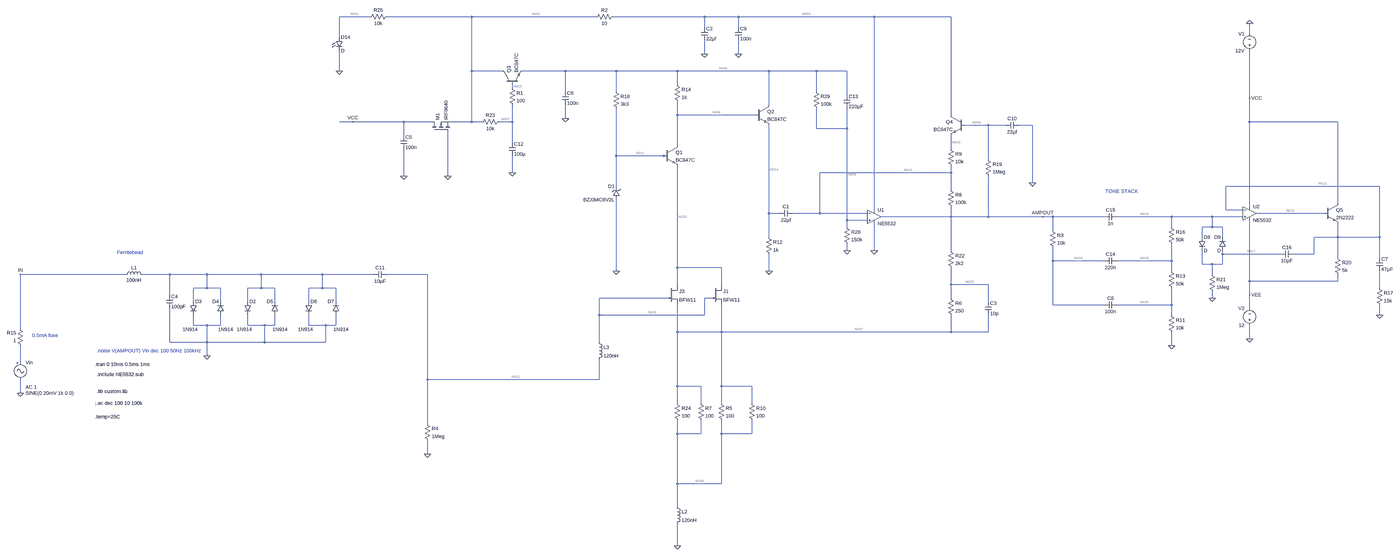
[diagram p0: schematic mosfetpre2.asc, whole sheet]
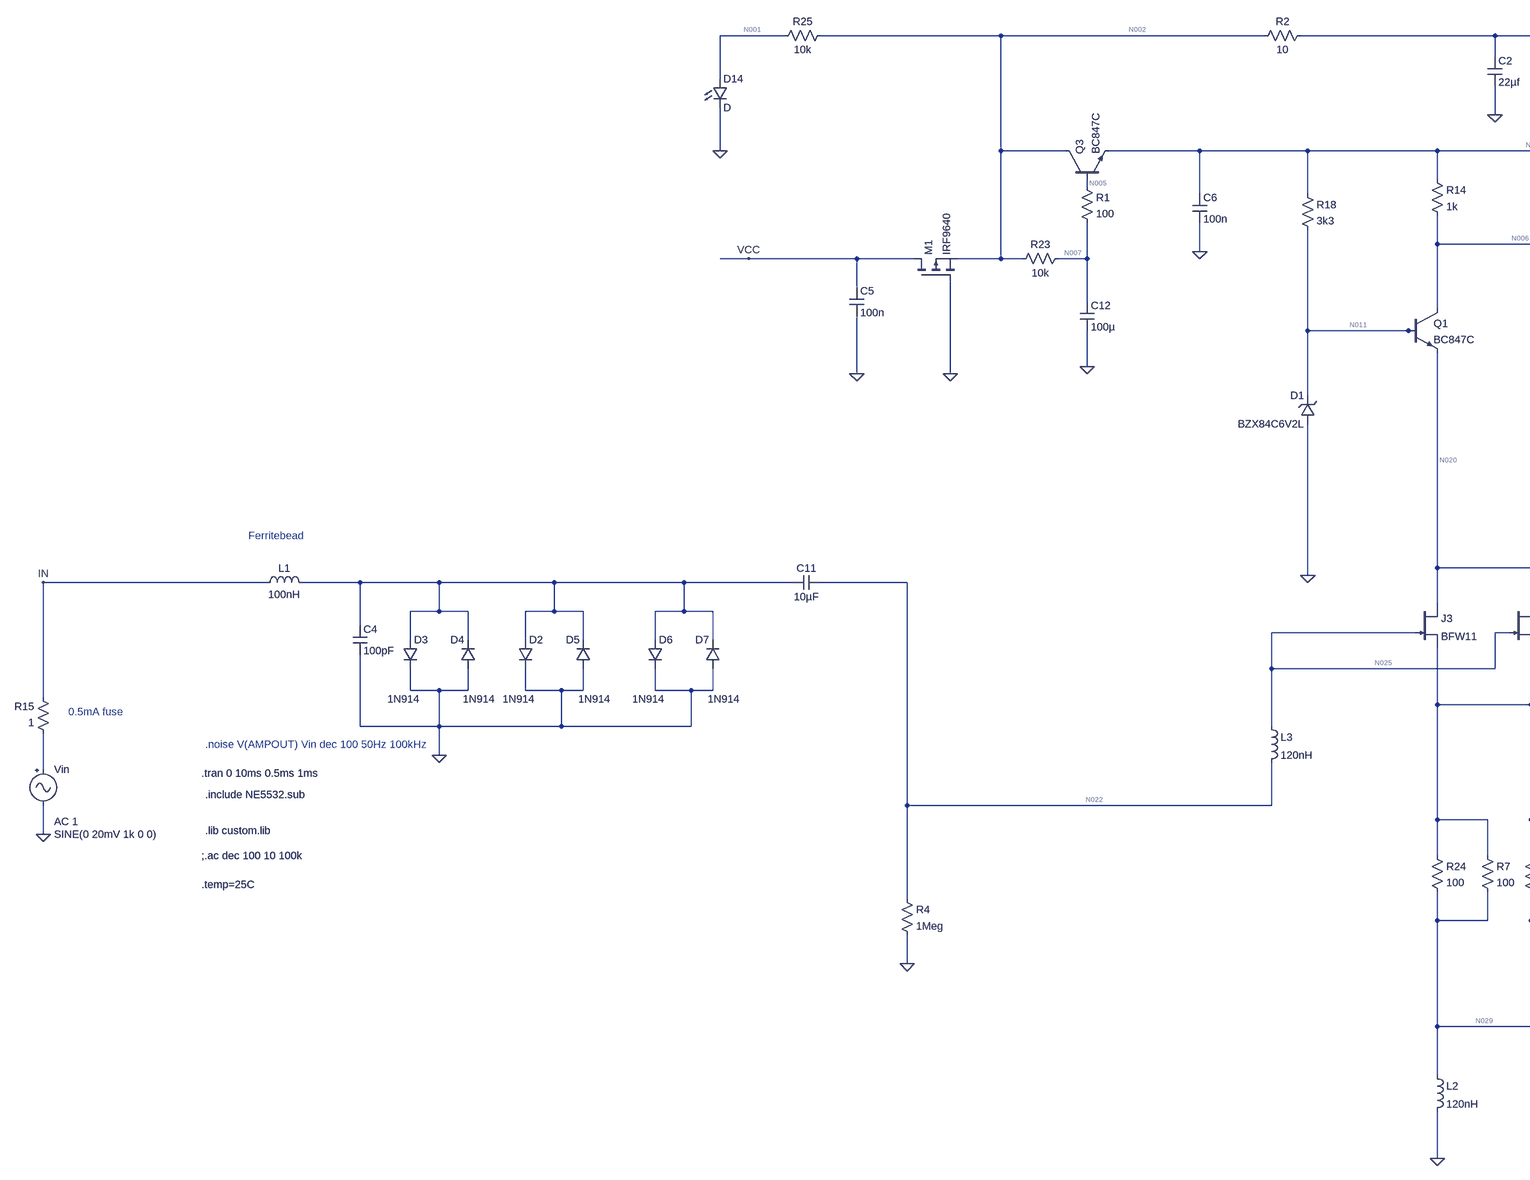
[diagram p1: schematic mosfetpre2.asc, part, row 1 of 1, column 1 of 2]
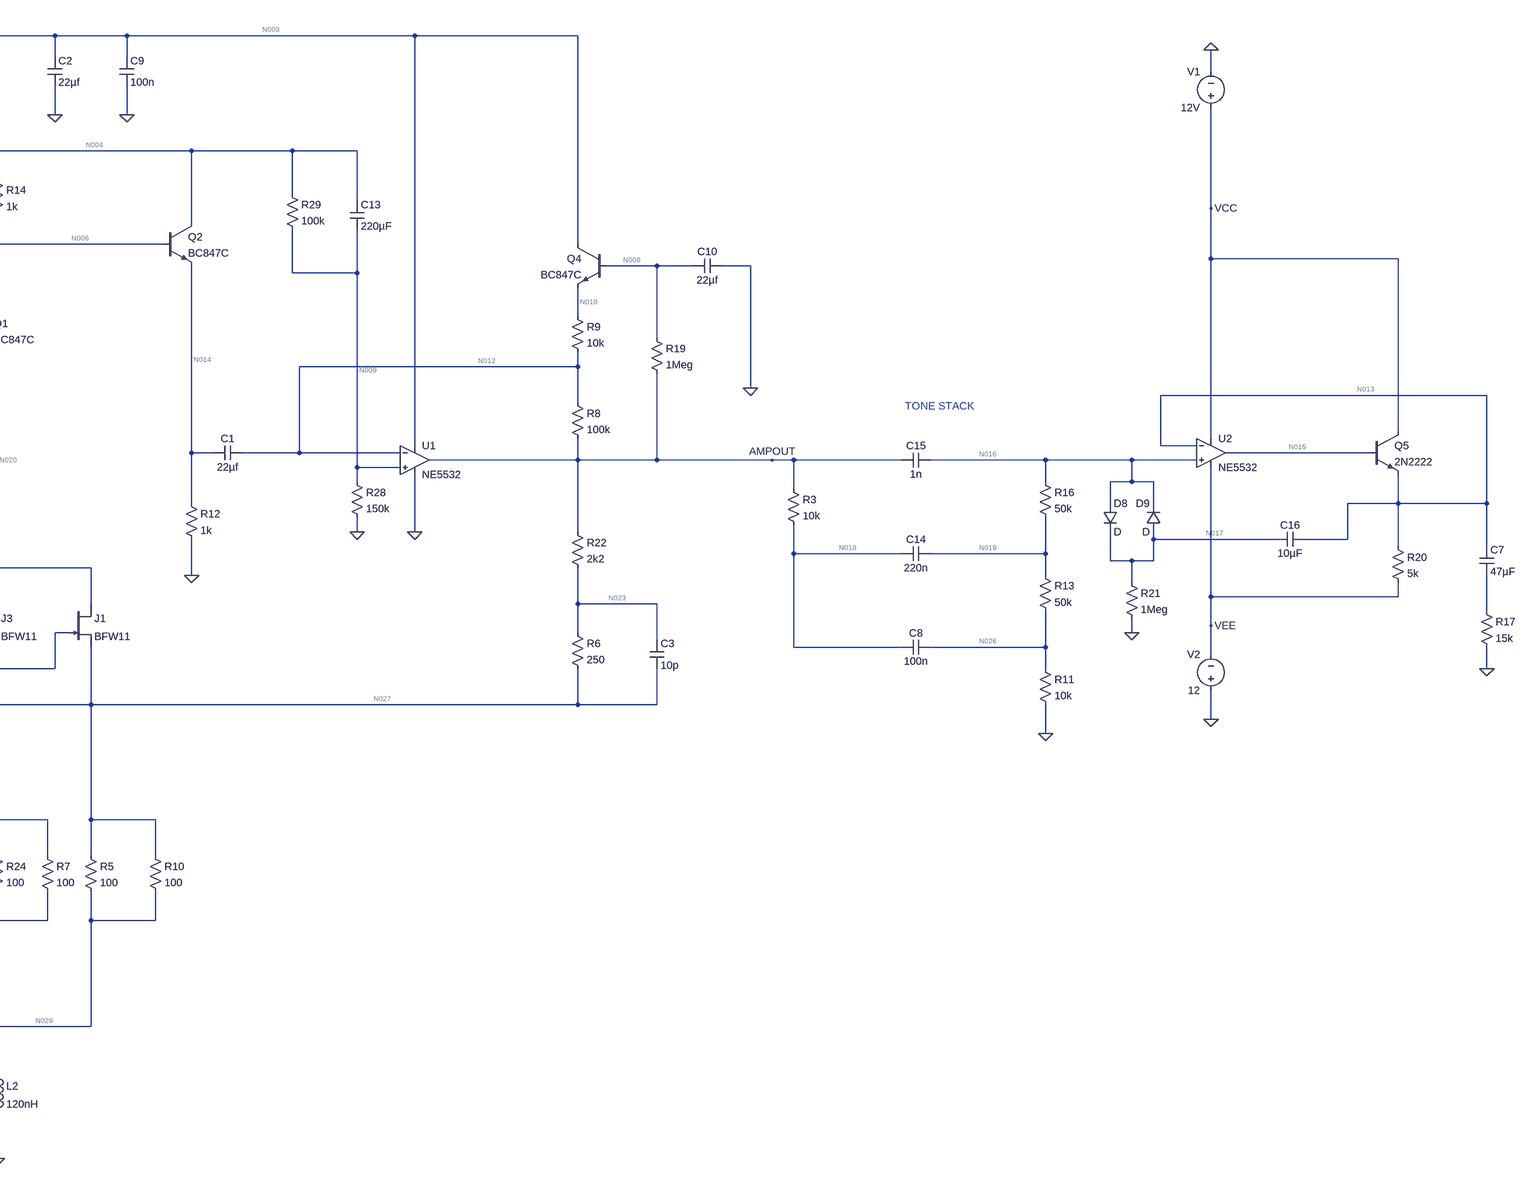
[diagram p2: schematic mosfetpre2.asc, part, row 1 of 1, column 2 of 2]
mosfetpre2.asc, the LTspice schematic file:
Version 4.1
SHEET 1 3440 1556
WIRE -5072 -1184 -5216 -1184
WIRE -4592 -1184 -4992 -1184
WIRE -3984 -1184 -4592 -1184
WIRE -3472 -1184 -3904 -1184
WIRE -3312 -1184 -3472 -1184
WIRE -2672 -1184 -3312 -1184
WIRE -2096 -1184 -2672 -1184
WIRE -3472 -1136 -3472 -1184
WIRE -3312 -1136 -3312 -1184
WIRE -688 -1104 -688 -1152
WIRE -5216 -1088 -5216 -1184
WIRE -3472 -1008 -3472 -1072
WIRE -3312 -1008 -3312 -1072
WIRE -5216 -928 -5216 -1024
WIRE -4592 -928 -4592 -1184
WIRE -4448 -928 -4592 -928
WIRE -4128 -928 -4352 -928
WIRE -3888 -928 -4128 -928
WIRE -3600 -928 -3888 -928
WIRE -3168 -928 -3600 -928
WIRE -2944 -928 -3168 -928
WIRE -2800 -928 -2944 -928
WIRE -3600 -864 -3600 -928
WIRE -4400 -848 -4400 -864
WIRE -4128 -832 -4128 -928
WIRE -3888 -832 -3888 -928
WIRE -2944 -832 -2944 -928
WIRE -2800 -816 -2800 -928
WIRE -688 -800 -688 -1024
WIRE -3168 -768 -3168 -928
WIRE -3600 -720 -3600 -784
WIRE -3232 -720 -3600 -720
WIRE -2096 -720 -2096 -1184
WIRE -4128 -704 -4128 -768
WIRE -5152 -688 -5216 -688
WIRE -4912 -688 -5152 -688
WIRE -4784 -688 -4912 -688
WIRE -4592 -688 -4592 -928
WIRE -4592 -688 -4688 -688
WIRE -4544 -688 -4592 -688
WIRE -4400 -688 -4400 -768
WIRE -4400 -688 -4464 -688
WIRE -688 -688 -688 -800
WIRE -272 -688 -688 -688
WIRE -1920 -672 -2032 -672
WIRE -1840 -672 -1920 -672
WIRE -1712 -672 -1776 -672
WIRE -2944 -656 -2944 -752
WIRE -2800 -656 -2800 -752
WIRE -2800 -656 -2944 -656
WIRE -4912 -624 -4912 -688
WIRE -4400 -592 -4400 -688
WIRE -3600 -576 -3600 -720
WIRE -2096 -560 -2096 -624
WIRE -3888 -528 -3888 -752
WIRE -3664 -528 -3888 -528
WIRE -3648 -528 -3664 -528
WIRE -1920 -512 -1920 -672
WIRE -4400 -448 -4400 -528
WIRE -2096 -448 -2096 -480
WIRE -2096 -448 -2928 -448
WIRE -4912 -432 -4912 -560
WIRE -4704 -432 -4704 -640
WIRE -1712 -400 -1712 -672
WIRE -3888 -384 -3888 -528
WIRE 112 -384 -800 -384
WIRE -2096 -368 -2096 -448
WIRE -272 -304 -272 -688
WIRE -688 -288 -688 -688
WIRE -2672 -272 -2672 -1184
WIRE -800 -272 -800 -384
WIRE -720 -272 -800 -272
WIRE -3168 -256 -3168 -672
WIRE -3120 -256 -3168 -256
WIRE -2928 -256 -2928 -448
WIRE -2928 -256 -3056 -256
WIRE -2704 -256 -2928 -256
WIRE -336 -256 -656 -256
WIRE -2096 -240 -2096 -288
WIRE -2096 -240 -2640 -240
WIRE -1920 -240 -1920 -432
WIRE -1920 -240 -2096 -240
WIRE -1664 -240 -1920 -240
WIRE -1616 -240 -1664 -240
WIRE -1376 -240 -1616 -240
WIRE -1056 -240 -1312 -240
WIRE -864 -240 -1056 -240
WIRE -720 -240 -864 -240
WIRE -2800 -224 -2800 -656
WIRE -2704 -224 -2800 -224
WIRE -2800 -192 -2800 -224
WIRE -1056 -192 -1056 -240
WIRE -864 -192 -864 -240
WIRE -864 -192 -912 -192
WIRE -816 -192 -864 -192
WIRE -1616 -176 -1616 -240
WIRE -3168 -144 -3168 -256
WIRE -912 -144 -912 -192
WIRE -816 -144 -816 -192
WIRE -272 -144 -272 -208
WIRE -272 -144 -384 -144
WIRE 112 -144 112 -384
WIRE 112 -144 -272 -144
WIRE -2800 -80 -2800 -112
WIRE -2672 -80 -2672 -208
WIRE -2096 -80 -2096 -240
WIRE -816 -64 -816 -80
WIRE -544 -64 -816 -64
WIRE -384 -64 -384 -144
WIRE -384 -64 -480 -64
WIRE -272 -48 -272 -144
WIRE 112 -48 112 -144
WIRE -1616 -32 -1616 -96
WIRE -1376 -32 -1616 -32
WIRE -1056 -32 -1056 -112
WIRE -1056 -32 -1312 -32
WIRE -912 -16 -912 -80
WIRE -864 -16 -912 -16
WIRE -816 -16 -816 -64
WIRE -816 -16 -864 -16
WIRE -3600 0 -3600 -480
WIRE -3392 0 -3600 0
WIRE -3888 16 -3888 -320
WIRE -3168 16 -3168 -64
WIRE -1056 16 -1056 -32
WIRE -6224 32 -6720 32
WIRE -6016 32 -6144 32
WIRE -5840 32 -6016 32
WIRE -5584 32 -5840 32
WIRE -5296 32 -5584 32
WIRE -5056 32 -5296 32
WIRE -4800 32 -4992 32
WIRE -864 32 -864 -16
WIRE -688 64 -688 -224
WIRE -272 64 -272 32
WIRE -272 64 -688 64
WIRE -3600 80 -3600 0
WIRE -3392 80 -3392 0
WIRE -2096 80 -2096 0
WIRE -1920 80 -2096 80
WIRE -5840 96 -5840 32
WIRE -5840 96 -5904 96
WIRE -5776 96 -5840 96
WIRE -5584 96 -5584 32
WIRE -5584 96 -5648 96
WIRE -5520 96 -5584 96
WIRE -5296 96 -5296 32
WIRE -5296 96 -5360 96
WIRE -5232 96 -5296 96
WIRE 112 96 112 16
WIRE -6016 128 -6016 32
WIRE -688 128 -688 64
WIRE -3648 144 -3968 144
WIRE -3440 144 -3472 144
WIRE -2096 144 -2096 80
WIRE -864 144 -864 112
WIRE -5904 160 -5904 96
WIRE -5776 160 -5776 96
WIRE -5648 160 -5648 96
WIRE -5520 160 -5520 96
WIRE -5360 160 -5360 96
WIRE -5232 160 -5232 96
WIRE -1920 160 -1920 80
WIRE -1616 176 -1616 -32
WIRE -1376 176 -1616 176
WIRE -1056 176 -1056 96
WIRE -1056 176 -1312 176
WIRE -688 192 -688 128
WIRE -3968 224 -3968 144
WIRE -3472 224 -3472 144
WIRE -3472 224 -3968 224
WIRE -1056 224 -1056 176
WIRE 112 224 112 176
WIRE -5904 272 -5904 224
WIRE -5840 272 -5904 272
WIRE -5776 272 -5776 224
WIRE -5776 272 -5840 272
WIRE -5648 272 -5648 224
WIRE -5568 272 -5648 272
WIRE -5520 272 -5520 224
WIRE -5520 272 -5568 272
WIRE -5360 272 -5360 224
WIRE -5280 272 -5360 272
WIRE -5232 272 -5232 224
WIRE -5232 272 -5280 272
WIRE -6720 288 -6720 32
WIRE -3600 304 -3600 176
WIRE -3392 304 -3392 176
WIRE -3392 304 -3600 304
WIRE -2096 304 -2096 224
WIRE -2096 304 -3392 304
WIRE -1920 304 -1920 224
WIRE -1920 304 -2096 304
WIRE -688 336 -688 272
WIRE -6016 352 -6016 192
WIRE -5840 352 -5840 272
WIRE -5840 352 -6016 352
WIRE -5568 352 -5568 272
WIRE -5568 352 -5840 352
WIRE -5280 352 -5280 272
WIRE -5280 352 -5568 352
WIRE -3968 352 -3968 224
WIRE -1056 368 -1056 304
WIRE -5840 416 -5840 352
WIRE -6720 448 -6720 368
WIRE -4800 528 -4800 32
WIRE -3968 528 -3968 432
WIRE -3968 528 -4800 528
WIRE -3600 560 -3600 304
WIRE -3488 560 -3600 560
WIRE -3392 560 -3392 304
WIRE -3248 560 -3392 560
WIRE -6720 592 -6720 528
WIRE -3600 640 -3600 560
WIRE -3488 640 -3488 560
WIRE -3392 640 -3392 560
WIRE -3248 640 -3248 560
WIRE -4800 736 -4800 528
WIRE -3600 784 -3600 720
WIRE -3488 784 -3488 720
WIRE -3488 784 -3600 784
WIRE -3392 784 -3392 720
WIRE -3248 784 -3248 720
WIRE -3248 784 -3392 784
WIRE -4800 880 -4800 816
WIRE -3600 1040 -3600 784
WIRE -3392 1040 -3392 784
WIRE -3392 1040 -3600 1040
WIRE -3600 1248 -3600 1040
WIRE -3600 1488 -3600 1328
FLAG -6720 592 0
FLAG -6720 32 IN
FLAG -4800 880 0
FLAG -5840 416 0
FLAG -3168 16 0
FLAG -3888 16 0
FLAG -2800 -80 0
FLAG -3600 1488 0
FLAG -1712 -400 0
FLAG -4704 -432 0
FLAG -4400 -448 0
FLAG -5216 -928 0
FLAG -3472 -1008 0
FLAG -3312 -1008 0
FLAG -4912 -432 0
FLAG -4128 -704 0
FLAG -1664 -240 AMPOUT
FLAG -2672 -80 0
FLAG -1056 368 0
FLAG -688 -1152 0
FLAG 112 224 0
FLAG -688 336 0
FLAG -5152 -688 VCC
FLAG -688 128 VEE
FLAG -688 -800 VCC
FLAG -864 144 0
DATAFLAG -3744 -528 ""
DATAFLAG -3856 144 ""
DATAFLAG -3568 304 ""
DATAFLAG -3600 -304 ""
DATAFLAG -3520 -720 ""
DATAFLAG -4032 -928 ""
DATAFLAG -4304 -1184 ""
SYMBOL Misc\\signal -6720 432 R0
WINDOW 123 24 132 Left 2
WINDOW 39 0 0 Left 0
WINDOW 3 24 160 Left 2
SYMATTR Value2 AC 1
SYMATTR Value SINE(0 20mV 1k 0 0)
SYMATTR InstName Vin
SYMBOL res -4816 720 R0
SYMATTR InstName R4
SYMATTR Value 1Meg
SYMBOL diode -5920 160 R0
WINDOW 3 -35 131 Left 2
SYMATTR Value 1N914
SYMATTR InstName D3
SYMBOL diode -5760 224 R180
WINDOW 0 24 64 Left 2
WINDOW 3 -44 -67 Left 2
SYMATTR InstName D4
SYMATTR Value 1N914
SYMBOL res -6704 384 R180
WINDOW 0 36 76 Left 2
WINDOW 3 36 40 Left 2
SYMATTR InstName R15
SYMATTR Value 1
SYMBOL cap -6032 128 R0
SYMATTR InstName C4
SYMATTR Value 100pF
SYMBOL ind -6240 48 R270
WINDOW 0 32 56 VTop 2
WINDOW 3 5 56 VBottom 2
SYMATTR InstName L1
SYMATTR Value 100nH
SYMBOL cap -4992 16 R90
WINDOW 0 0 32 VBottom 2
WINDOW 3 32 32 VTop 2
SYMATTR InstName C11
SYMATTR Value 10µF
SYMBOL cap -3056 -272 R90
WINDOW 0 0 32 VBottom 2
WINDOW 3 32 32 VTop 2
SYMATTR InstName C1
SYMATTR Value 22µf
SYMBOL res -3184 -160 R0
SYMATTR InstName R12
SYMATTR Value 1k
SYMBOL res -3904 -848 R0
SYMATTR InstName R18
SYMATTR Value 3k3
SYMBOL res -3616 -880 R0
SYMATTR InstName R14
SYMATTR Value 1k
SYMBOL npn -2032 -720 M0
SYMATTR InstName Q4
SYMATTR Value BC847C
SYMBOL res -2112 -96 R0
SYMATTR InstName R22
SYMATTR Value 2k2
SYMBOL njf -3648 80 R0
SYMATTR InstName J3
SYMATTR Value BFW11
SYMBOL res -3616 624 R0
SYMATTR InstName R24
SYMATTR Value 100
SYMBOL res -1936 -528 R0
SYMATTR InstName R19
SYMATTR Value 1Meg
SYMBOL ind -3616 1232 R0
SYMATTR InstName L2
SYMATTR Value 120nH
SYMBOL ind -3984 336 R0
SYMATTR InstName L3
SYMATTR Value 120nH
SYMBOL cap -1776 -688 R90
WINDOW 0 0 32 VBottom 2
WINDOW 3 32 32 VTop 2
SYMATTR InstName C10
SYMATTR Value 22µf
SYMBOL pmos -4784 -640 R270
SYMATTR InstName M1
SYMATTR Value IRF9640
SYMBOL res -4416 -864 R0
SYMATTR InstName R1
SYMATTR Value 100
SYMBOL res -4448 -704 R90
WINDOW 0 0 56 VBottom 2
WINDOW 3 32 56 VTop 2
SYMATTR InstName R23
SYMATTR Value 10k
SYMBOL cap -4416 -592 R0
SYMATTR InstName C12
SYMATTR Value 100µ
SYMBOL res -4976 -1200 R90
WINDOW 0 0 56 VBottom 2
WINDOW 3 32 56 VTop 2
SYMATTR InstName R25
SYMATTR Value 10k
SYMBOL LED -5232 -1088 R0
SYMATTR InstName D14
SYMBOL res -2816 -208 R0
SYMATTR InstName R28
SYMATTR Value 150k
SYMBOL cap -2816 -816 R0
SYMATTR InstName C13
SYMATTR Value 220µF
SYMBOL res -2960 -848 R0
SYMATTR InstName R29
SYMATTR Value 100k
SYMBOL cap -3488 -1136 R0
SYMATTR InstName C2
SYMATTR Value 22µf
SYMBOL cap -3328 -1136 R0
SYMATTR InstName C9
SYMATTR Value 100n
SYMBOL res -3888 -1200 R90
WINDOW 0 0 56 VBottom 2
WINDOW 3 32 56 VTop 2
SYMATTR InstName R2
SYMATTR Value 10
SYMBOL cap -4928 -624 R0
SYMATTR InstName C5
SYMATTR Value 100n
SYMBOL cap -4144 -832 R0
SYMATTR InstName C6
SYMATTR Value 100n
SYMBOL res -1632 -192 R0
SYMATTR InstName R3
SYMATTR Value 10k
SYMBOL npn -3664 -576 R0
SYMATTR InstName Q1
SYMATTR Value BC847C
SYMBOL npn -4448 -864 R270
SYMATTR InstName Q3
SYMATTR Value BC847C
SYMBOL npn -3232 -768 R0
SYMATTR InstName Q2
SYMATTR Value BC847C
SYMBOL OpAmps\\opamp2 -2672 -304 R0
SYMATTR InstName U1
SYMATTR Value NE5532
SYMBOL njf -3440 80 R0
SYMATTR InstName J1
SYMATTR Value BFW11
SYMBOL res -3408 624 R0
SYMATTR InstName R5
SYMATTR Value 100
SYMBOL zener -3872 -320 R180
WINDOW 0 24 64 Left 2
WINDOW 3 24 0 Left 2
SYMATTR InstName D1
SYMATTR Value BZX84C6V2L
SYMBOL res -2112 128 R0
SYMATTR InstName R6
SYMATTR Value 250
SYMBOL cap -1936 160 R0
SYMATTR InstName C3
SYMATTR Value 10p
SYMBOL res -2112 -384 R0
SYMATTR InstName R8
SYMATTR Value 100k
SYMBOL res -2112 -576 R0
SYMATTR InstName R9
SYMATTR Value 10k
SYMBOL res -3504 624 R0
SYMATTR InstName R7
SYMATTR Value 100
SYMBOL res -3264 624 R0
SYMATTR InstName R10
SYMATTR Value 100
SYMBOL diode -5664 160 R0
WINDOW 3 -35 131 Left 2
SYMATTR Value 1N914
SYMATTR InstName D2
SYMBOL diode -5504 224 R180
WINDOW 0 24 64 Left 2
WINDOW 3 -44 -67 Left 2
SYMATTR InstName D5
SYMATTR Value 1N914
SYMBOL diode -5376 160 R0
WINDOW 3 -35 131 Left 2
SYMATTR Value 1N914
SYMATTR InstName D6
SYMBOL diode -5216 224 R180
WINDOW 0 24 64 Left 2
WINDOW 3 -44 -67 Left 2
SYMATTR InstName D7
SYMATTR Value 1N914
SYMBOL cap -1312 160 R90
WINDOW 0 0 32 VBottom 2
WINDOW 3 32 32 VTop 2
SYMATTR InstName C8
SYMATTR Value 100n
SYMBOL cap -1312 -48 R90
WINDOW 0 0 32 VBottom 2
WINDOW 3 32 32 VTop 2
SYMATTR InstName C14
SYMATTR Value 220n
SYMBOL cap -1312 -256 R90
WINDOW 0 0 32 VBottom 2
WINDOW 3 32 32 VTop 2
SYMATTR InstName C15
SYMATTR Value 1n
SYMBOL res -1072 208 R0
SYMATTR InstName R11
SYMATTR Value 10k
SYMBOL res -1072 0 R0
SYMATTR InstName R13
SYMATTR Value 50k
SYMBOL res -1072 -208 R0
SYMATTR InstName R16
SYMATTR Value 50k
SYMBOL OpAmps\\opamp2 -688 -320 R0
SYMATTR InstName U2
SYMATTR Value NE5532
SYMBOL voltage -688 -1008 R180
WINDOW 0 24 96 Left 2
WINDOW 3 24 16 Left 2
WINDOW 123 0 0 Left 0
WINDOW 39 0 0 Left 0
SYMATTR InstName V1
SYMATTR Value 12V
SYMBOL res 96 80 R0
SYMATTR InstName R17
SYMATTR Value 15k
SYMBOL voltage -688 288 R180
WINDOW 0 24 96 Left 2
WINDOW 3 24 16 Left 2
WINDOW 123 0 0 Left 0
WINDOW 39 0 0 Left 0
SYMATTR InstName V2
SYMATTR Value 12
SYMBOL npn -336 -304 R0
SYMATTR InstName Q5
SYMATTR Value 2N2222
SYMBOL res -288 -64 R0
SYMATTR InstName R20
SYMATTR Value 5k
SYMBOL cap 96 -48 R0
SYMATTR InstName C7
SYMATTR Value 47µF
SYMBOL diode -928 -144 R0
SYMATTR InstName D8
SYMBOL diode -800 -80 R180
WINDOW 0 24 64 Left 2
WINDOW 3 24 0 Left 2
SYMATTR InstName D9
SYMBOL res -880 16 R0
SYMATTR InstName R21
SYMATTR Value 1Meg
SYMBOL cap -480 -80 R90
WINDOW 0 0 32 VBottom 2
WINDOW 3 32 32 VTop 2
SYMATTR InstName C16
SYMATTR Value 10µF
TEXT -6360 584 Left 2 !.lib custom.lib
TEXT -6360 392 Left 2 ;.noise V(AMPOUT) Vin dec 100 50Hz 100kHz
TEXT -6368 456 Left 2 !.tran 0 10ms 0.5ms 1ms
TEXT -6368 640 Left 2 !;.ac dec 100 10 100k
TEXT -6664 320 Left 2 ;0.5mA fuse
TEXT -6264 -72 Left 2 ;Ferritebead
TEXT -6368 704 Left 2 !.temp=25C
TEXT -6360 504 Left 2 !.include NE5532.sub
TEXT -1368 -360 Left 2 ;TONE STACK

The netlist it stands for:
* mosfetpre2.asc
Vin N028 0 SINE(0 20mV 1k 0 0) AC 1
R4 N022 0 1Meg
D3 N021 0 1N914
D4 0 N021 1N914
R15 N028 IN 1
C4 N021 0 100pF
L1 IN N021 100nH
C11 N022 N021 10µF
C1 N012 N014 22µf
R12 N014 0 1k
R18 N004 N011 3k3
R14 N004 N006 1k
Q4 N003 N008 N010 0 BC847C
R22 AMPOUT N023 2k2
J3 N020 N025 N027 BFW11
R24 N027 N029 100
R19 N008 AMPOUT 1Meg
L2 N029 0 120nH
L3 N025 N022 120nH
C10 0 N008 22µf
M1 VCC 0 N002 N002 IRF9640
R1 N005 N007 100
R23 N007 N002 10k
C12 N007 0 100µ
R25 N002 N001 10k
D14 N001 0 D
R28 N009 0 150k
C13 N004 N009 220µF
R29 N004 N009 100k
C2 N003 0 22µf
C9 N003 0 100n
R2 N003 N002 10
C5 VCC 0 100n
C6 N004 0 100n
R3 AMPOUT N018 10k
Q1 N006 N011 N020 0 BC847C
Q3 N002 N005 N004 0 BC847C
Q2 N004 N006 N014 0 BC847C
X§U1 N009 N012 N003 0 AMPOUT NE5532  ; pins In+ In- V+ V- OUT
J1 N020 N025 N027 BFW11
R5 N027 N029 100
D1 0 N011 BZX84C6V2L
R6 N023 N027 250
C3 N023 N027 10p
R8 N012 AMPOUT 100k
R9 N010 N012 10k
R7 N027 N029 100
R10 N027 N029 100
D2 N021 0 1N914
D5 0 N021 1N914
D6 N021 0 1N914
D7 0 N021 1N914
C8 N026 N018 100n
C14 N019 N018 220n
C15 N016 AMPOUT 1n
R11 N026 0 10k
R13 N019 N026 50k
R16 N016 N019 50k
X§U2 N016 N013 VCC VEE N015 NE5532  ; pins In+ In- V+ V- OUT
V1 VCC 0 12V
R17 N024 0 15k
V2 0 VEE 12
Q5 VCC N015 N013 0 2N2222
R20 N013 VEE 5k
C7 N013 N024 47µF
D8 N016 N017 D
D9 N017 N016 D
R21 N017 0 1Meg
C16 N013 N017 10µF
.model D D
.lib standard.dio
.model NPN NPN
.model PNP PNP
.lib standard.bjt
.model NJF NJF
.model PJF PJF
.lib standard.jft
.model NMOS NMOS
.model PMOS PMOS
.lib standard.mos
.lib custom.lib
* .noise V(AMPOUT) Vin dec 100 50Hz 100kHz
.tran 0 10ms 0.5ms 1ms
;.ac dec 100 10 100k
* 0.5mA fuse
* Ferritebead
.temp=25C
.include NE5532.sub
* TONE STACK
.backanno
.end

* Results of the author's LTspice run, read from the files saved beside the schematic
* Operating Point, zero values left out:
*   V(n022) = 9.322 µV
*   V(n012) = 6.573 V
*   V(n003) = 11.98 V
*   V(ampout) = 6.623 V
*   V(n029) = 10.96 µV
*   V(n001) = 661.9 mV
*   V(n026) = -4.982 mV
*   V(n015) = 624.1 mV
*   V(n004) = 11.01 V
*   V(n010) = 6.573 V
*   V(n020) = 4.387 V
*   V(n002) = 12 V
*   V(n018) = 6.623 V
*   V(n016) = -54.8 mV
*   V(n017) = -170.7 nV
*   V(vee) = -12 V
*   V(n014) = 3.744 V
*   V(n006) = 4.41 V
*   V(n023) = 922 mV
*   V(n027) = 274.1 mV
*   V(vcc) = 12 V
*   V(n007) = 11.72 V
*   V(n019) = -29.89 mV
*   V(n013) = -54.8 mV
*   V(n011) = 5.119 V
*   V(n008) = 6.623 V
*   V(n025) = 9.322 µV
*   V(n005) = 11.71 V
*   V(n009) = 6.573 V
*   I(R8) = -499.7 nA
*   I(R22) = 2.591 mA
*   I(R28) = 43.82 µA
*   Id(J1) = 4.186 mA
*   Ig(J1) = -4.661 pA
*   Is(J1) = -4.186 mA
*   I(L3) = 9.322 pA
*   I(R2) = -1.676 mA
*   I(R18) = 1.784 mA
*   Ic(Q5) = 2.379 mA
*   Ib(Q5) = 10.86 µA
*   Ie(Q5) = -2.39 mA
*   Ic(Q3) = 12.13 mA
*   Ib(Q3) = 27.91 µA
*   Ie(Q3) = -12.16 mA
*   I(R16) = -498.2 nA
*   I(R24) = 2.741 mA
*   I(R7) = 2.741 mA
*   Id(M1) = 14.97 mA
*   Is(M1) = -14.97 mA
*   I(V1) = -20.57 mA
*   I(R29) = 44.32 µA
*   I(D1) = -1.916 nA
*   Ic(Q4) = 11.43 pA
*   Ib(Q4) = -11.25 pA
*   I(D14) = 1.133 mA
*   I(R13) = -498.2 nA
*   I(R4) = 9.322 pA
*   I(R12) = 3.744 mA
*   I(R23) = -27.91 µA
*   I(L2) = 10.96 mA
*   I(V2) = -5.616 mA
*   I(R5) = 2.741 mA
*   Id(J3) = 4.186 mA
*   Ig(J3) = -4.661 pA
*   Is(J3) = -4.186 mA
*   Ic(Q1) = 6.588 mA
*   Ib(Q1) = 1.784 mA
*   Ie(Q1) = -8.372 mA
*   I(R20) = 2.389 mA
*   I(R14) = 6.595 mA
*   I(R25) = 1.133 mA
*   Ic(Q2) = 3.737 mA
*   Ib(Q2) = 6.949 µA
*   Ie(Q2) = -3.744 mA
*   I(R6) = 2.591 mA
*   I(R10) = 2.741 mA
*   I(R11) = -498.2 nA
*   I(R19) = 11.25 pA
*   I(R1) = -27.91 µA
*   Ix(u2:1) = 498.2 nA
*   Ix(u2:2) = 498.2 nA
*   Ix(u2:3) = 3.225 mA
*   Ix(u2:4) = -3.227 mA
*   Ix(u2:5) = -10.86 µA
*   Ix(u1:1) = 499.8 nA
*   Ix(u1:2) = 499.7 nA
*   Ix(u1:3) = 1.676 mA
*   Ix(u1:4) = -1.677 mA
*   Ix(u1:5) = -2.592 mA
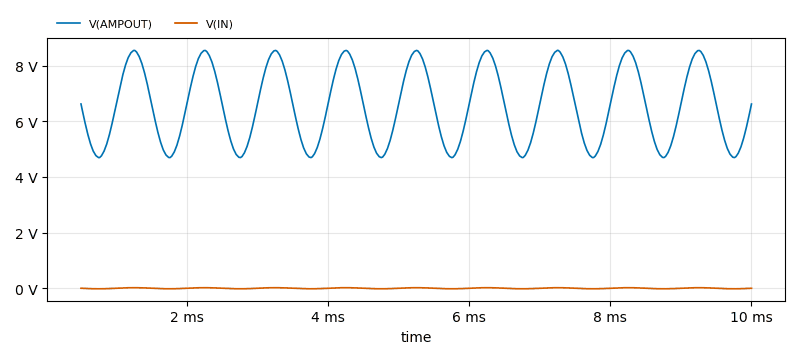
[diagram p3: Transient Analysis of mosfetpre2.asc, plotted from the saved traces]
* Transient Analysis, 1 run:
*   V(AMPOUT): min 4.693 V, max 8.548 V, average 6.557 V, rms 6.695 V, last 6.619 V
*   V(IN): min -19.89 mV, max 19.89 mV, average -659.2 µV, rms 13.98 mV, last -15.85 nV